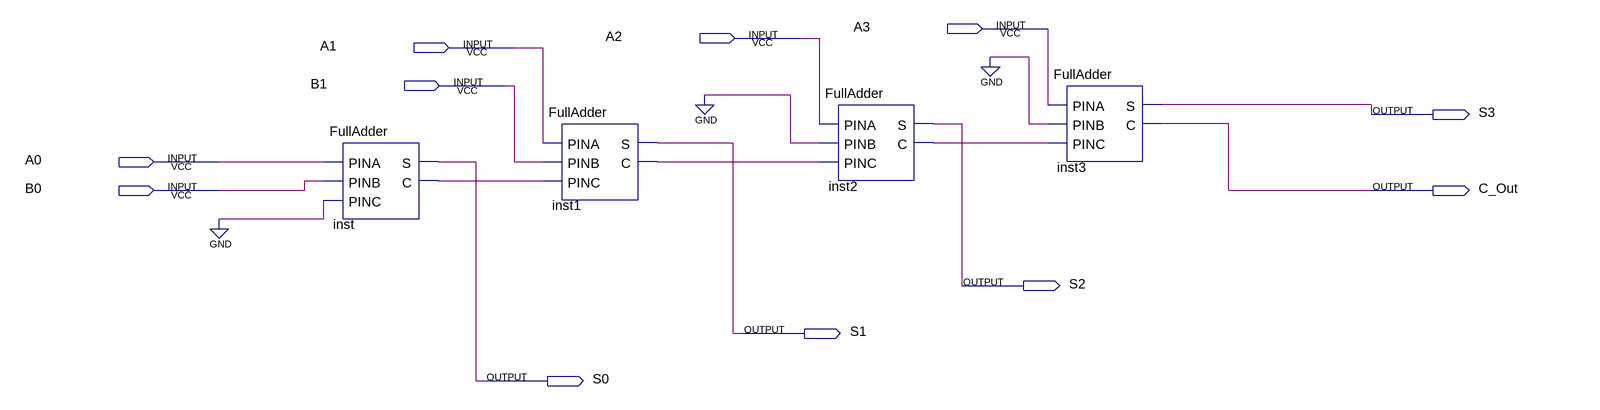
[diagram p0: schematic sheet]
// Quartus schematic four_bit_adder.bdf as structural Verilog: 4 symbols, 11 pins
module four_bit_adder (
  input  A3,
  input  A2,
  input  A1,
  input  B1,
  input  A0,
  input  B0,
  output S3,
  output C_Out,
  output S2,
  output S1,
  output S0
);

  wire inst1_c, inst2_c, inst_c;

  FullAdder inst (.PINA(A0), .PINB(B0), .PINC(1'b0), .S(S0), .C(inst_c));
  FullAdder inst1 (.PINA(A1), .PINB(B1), .PINC(inst_c), .S(S1), .C(inst1_c));
  FullAdder inst2 (.PINA(A2), .PINB(1'b0), .PINC(inst1_c), .S(S2), .C(inst2_c));
  FullAdder inst3 (.PINA(A3), .PINB(1'b0), .PINC(inst2_c), .S(S3), .C(C_Out));
endmodule
